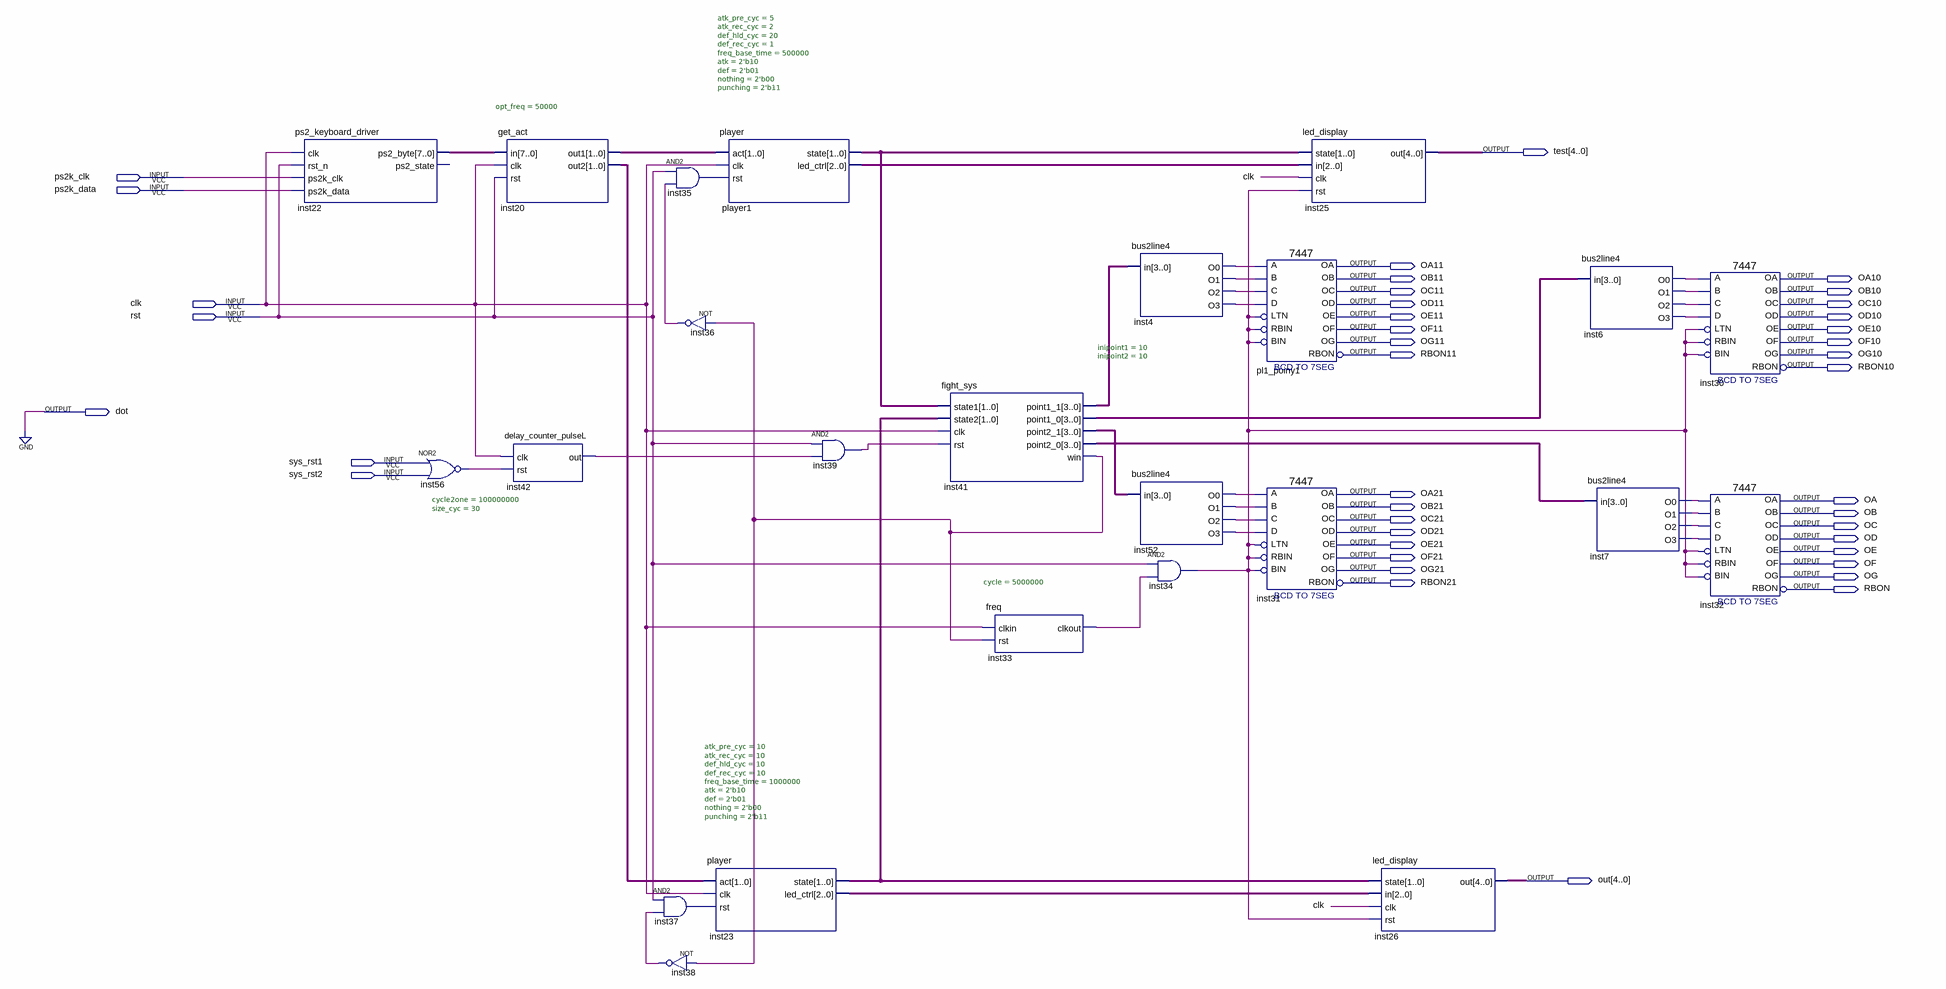
[diagram p0: schematic sheet]
// Quartus schematic final_project.bdf as structural Verilog: 24 symbols, 41 pins
module final_project (
  input  ps2k_clk,
  input  ps2k_data,
  input  clk,
  input  rst,
  input  sys_rst1,
  input  sys_rst2,
  output [4:0] test,
  output OA11,
  output OB11,
  output OA10,
  output OC11,
  output OB10,
  output OD11,
  output OC10,
  output OE11,
  output OD10,
  output OF11,
  output OE10,
  output OG11,
  output OF10,
  output RBON11,
  output OG10,
  output RBON10,
  output dot,
  output OA21,
  output OA,
  output OB21,
  output OB,
  output OC21,
  output OC,
  output OD21,
  output OD,
  output OE21,
  output OE,
  output OF21,
  output OF,
  output OG21,
  output OG,
  output RBON21,
  output RBON,
  output [4:0] out
);

  wire inst4_o0, inst4_o1, inst4_o2, inst4_o3, inst6_o0, inst6_o1, inst6_o2, inst6_o3, inst7_o0, inst7_o1,
       inst7_o2, inst7_o3, inst33_clkout, inst34_out, inst35_out, inst36_out, inst37_out, inst38_out,
       inst39_out, inst41_win, inst42_out, inst52_o0, inst52_o1, inst52_o2, inst52_o3, inst56_out;
  wire [1:0] inst20_out1, inst20_out2, inst23_state, player1_state;
  wire [2:0] inst23_led_ctrl, player1_led_ctrl;
  wire [3:0] inst41_point1_0, inst41_point1_1, inst41_point2_0, inst41_point2_1;
  wire [7:0] inst22_ps2_byte;

  ps2_keyboard_driver inst22 (
    .clk(clk), .rst_n(rst), .ps2k_clk(ps2k_clk), .ps2k_data(ps2k_data), .ps2_byte(inst22_ps2_byte));  // open: ps2_state
  nor inst56 (inst56_out, sys_rst1, sys_rst2);
  get_act #(.opt_freq(50000)) inst20 (
    .in(inst22_ps2_byte), .clk(clk), .rst(rst), .out1(inst20_out1), .out2(inst20_out2));
  delay_counter_pulseL #(.cycle2one(100000000), .size_cyc(30)) inst42 (.clk(clk), .rst(inst56_out), .out(inst42_out));
  and inst35 (inst35_out, rst, inst36_out);
  not inst36 (inst36_out, inst41_win);
  and inst37 (inst37_out, rst, inst38_out);
  not inst38 (inst38_out, inst41_win);
  player #(.atk_pre_cyc(5), .atk_rec_cyc(2), .def_hld_cyc(20), .def_rec_cyc(1), .freq_base_time(500000), .atk(2'b10), .def(2'b01), .nothing(2'b00), .punching(2'b11)) player1 (
    .act(inst20_out1), .clk(clk), .rst(inst35_out), .state(player1_state), .led_ctrl(player1_led_ctrl));
  player #(.atk_pre_cyc(10), .atk_rec_cyc(10), .def_hld_cyc(10), .def_rec_cyc(10), .freq_base_time(1000000), .atk(2'b10), .def(2'b01), .nothing(2'b00), .punching(2'b11)) inst23 (
    .act(inst20_out2), .clk(clk), .rst(inst37_out), .state(inst23_state), .led_ctrl(inst23_led_ctrl));
  and inst39 (inst39_out, rst, inst42_out);
  fight_sys #(.inipoint1(10), .inipoint2(10)) inst41 (
    .state1(player1_state), .state2(inst23_state), .clk(clk), .rst(inst39_out), .point1_1(inst41_point1_1),
    .point1_0(inst41_point1_0), .point2_1(inst41_point2_1), .point2_0(inst41_point2_0), .win(inst41_win));
  freq #(.cycle(5000000)) inst33 (.clkin(clk), .rst(inst41_win), .clkout(inst33_clkout));
  bus2line4 inst4 (.in(inst41_point1_1), .O0(inst4_o0), .O1(inst4_o1), .O2(inst4_o2), .O3(inst4_o3));
  bus2line4 inst52 (.in(inst41_point2_1), .O0(inst52_o0), .O1(inst52_o1), .O2(inst52_o2), .O3(inst52_o3));
  and inst34 (inst34_out, rst, inst33_clkout);
  \7447  pl1_poiny1 (
    .LTN(inst34_out), .B(inst4_o1), .C(inst4_o2), .D(inst4_o3), .RBIN(inst34_out), .BIN(inst34_out),
    .A(inst4_o0), .OB(OB11), .OC(OC11), .OE(OE11), .OD(OD11), .OF(OF11), .OG(OG11), .OA(OA11), .RBON(RBON11));
  \7447  inst31 (
    .LTN(inst34_out), .B(inst52_o1), .C(inst52_o2), .D(inst52_o3), .RBIN(inst34_out), .BIN(inst34_out),
    .A(inst52_o0), .OB(OB21), .OC(OC21), .OE(OE21), .OD(OD21), .OF(OF21), .OG(OG21), .OA(OA21), .RBON(RBON21));
  led_display inst25 (.state(player1_state), .in(player1_led_ctrl), .clk(clk), .rst(inst34_out), .out(test));
  led_display inst26 (.state(inst23_state), .in(inst23_led_ctrl), .clk(clk), .rst(inst34_out), .out(out));
  bus2line4 inst6 (.in(inst41_point1_0), .O0(inst6_o0), .O1(inst6_o1), .O2(inst6_o2), .O3(inst6_o3));
  bus2line4 inst7 (.in(inst41_point2_0), .O0(inst7_o0), .O1(inst7_o1), .O2(inst7_o2), .O3(inst7_o3));
  \7447  inst30 (
    .LTN(inst34_out), .B(inst6_o1), .C(inst6_o2), .D(inst6_o3), .RBIN(inst34_out), .BIN(inst34_out),
    .A(inst6_o0), .OB(OB10), .OC(OC10), .OE(OE10), .OD(OD10), .OF(OF10), .OG(OG10), .OA(OA10), .RBON(RBON10));
  \7447  inst32 (
    .LTN(inst34_out), .B(inst7_o1), .C(inst7_o2), .D(inst7_o3), .RBIN(inst34_out), .BIN(inst34_out),
    .A(inst7_o0), .OB(OB), .OC(OC), .OE(OE), .OD(OD), .OF(OF), .OG(OG), .OA(OA), .RBON(RBON));

  assign dot = 1'b0;
endmodule
